# EAGLE design rpi (EAGLE 9.6.2)
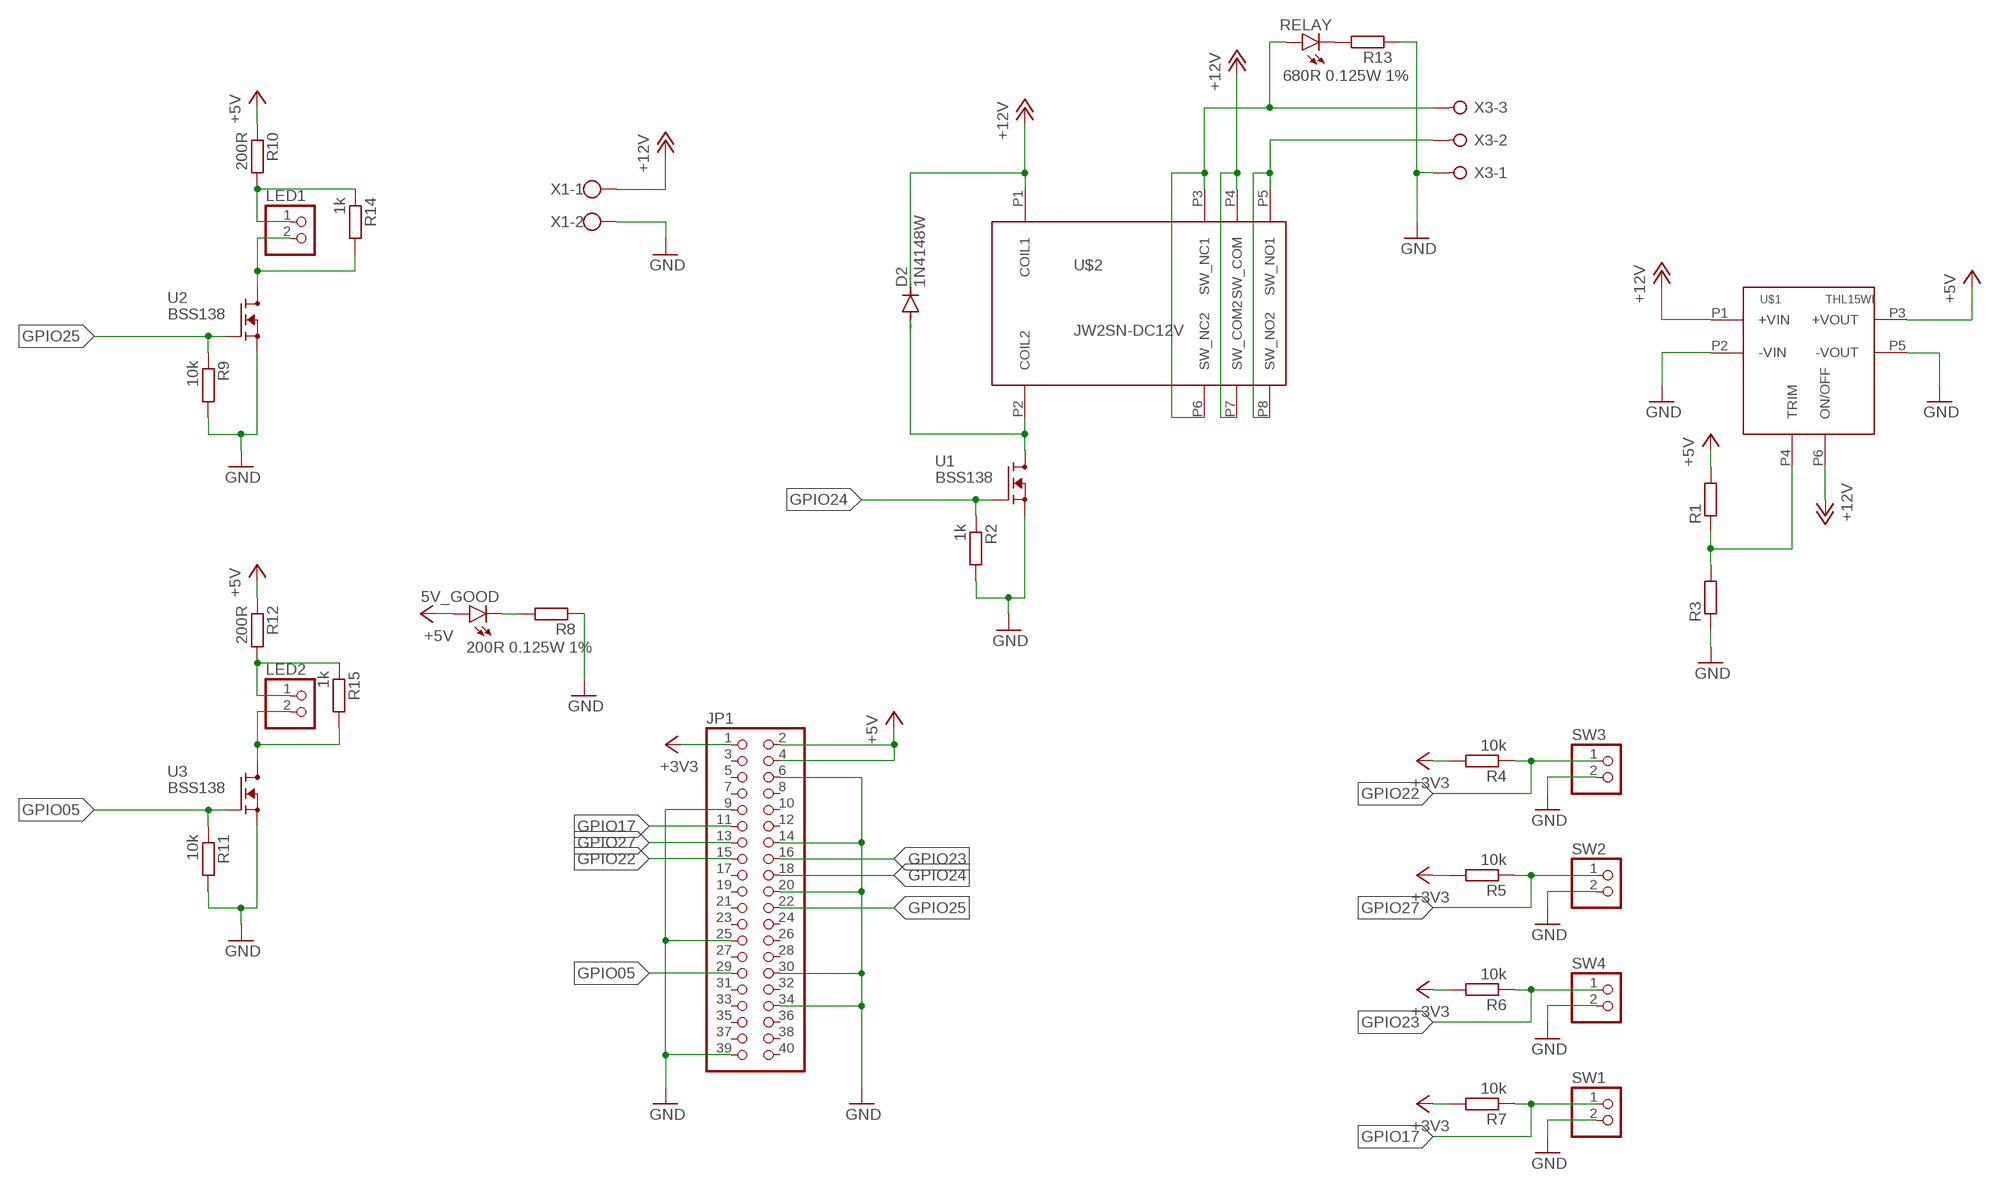
[diagram p0: schematic, sheet 1]

## Parts
5V_GOOD  LEDCHIPLED_0805  [CHIPLED_0805]
D2  1N4148W  CGRM4001-G  [SOD-123_MINI-SMA]
JP1  PINHD-2X20  [2X20]
LED1  PINHD-1X2  [1X02]
LED2  PINHD-1X2  [1X02]
R1  R-EU_R0805  [R0805]
R2  1k  R-EU_R0805  [R0805]
R3  R-EU_R0805  [R0805]
R4  10k  R-EU_R0805  [R0805]
R5  10k  R-EU_R0805  [R0805]
R6  10k  R-EU_R0805  [R0805]
R7  10k  R-EU_R0805  [R0805]
R8  200R 0.125W 1%  R-EU_R0805  [R0805]
R9  10k  R-EU_R0805  [R0805]
R10  200R  R-EU_R0805  [R0805]
R11  10k  R-EU_R0805  [R0805]
R12  200R  R-EU_R0805  [R0805]
R13  680R 0.125W 1%  R-EU_R0805  [R0805]
R14  1k  R-EU_R0805  [R0805]
R15  1k  R-EU_R0805  [R0805]
RELAY  LEDCHIPLED_0805  [CHIPLED_0805]
SW1  PINHD-1X2  [1X02]
SW2  PINHD-1X2  [1X02]
SW3  PINHD-1X2  [1X02]
SW4  PINHD-1X2  [1X02]
U1  BSS138  [SOT23]
U2  BSS138  [SOT23]
U3  BSS138  [SOT23]
U$1  THL15WI  [THL15WI]
U$2  JW2SN-DC12V  [JW2FORMC]
X1  W237-102  [W237-102]
X3  W237-3E  [W237-3E]

## Nets
12VNC [FPGA]: RELAY.A U$2.P3(SW_NC1) U$2.P6(SW_NC2) X3.3
+3V3: JP1.1 R4.2 R5.2 R6.2 R7.2
+5V: 5V_GOOD.A JP1.2 JP1.4 R1.2 R10.1 R12.1 U$1.P3(+VOUT)
+12V: D2.C U$1.P1(+VIN) U$1.P6(ON/OFF) U$2.P1(COIL1) U$2.P4(SW_COM) U$2.P7(SW_COM2) X1.1
GND: JP1.6 JP1.9 JP1.14 JP1.20 JP1.25 JP1.30 JP1.34 JP1.39 R2.2 R3.1 R8.1 R9.2 R11.2 R13.1 SW1.2 SW2.2 SW3.2 SW4.2 U1.2(S) U2.2(S) U3.2(S) U$1.P2(-VIN) U$1.P5(-VOUT) X1.2 X3.1
GPIO05: JP1.29 R11.1 U3.1(G)
GPIO17: JP1.11 R7.1 SW1.1
GPIO22: JP1.15 R4.1 SW3.1
GPIO23: JP1.16 R6.1 SW4.1
GPIO24: JP1.18 R2.1 U1.1(G)
GPIO25: JP1.22 R9.1 U2.1(G)
GPIO27: JP1.13 R5.1 SW2.1
N$1: R1.1 R3.2 U$1.P4(TRIM)
N$2: D2.A U1.3(D) U$2.P2(COIL2)
N$3: LED1.2 R14.2 U2.3(D)
N$4: U$2.P5(SW_NO1) U$2.P8(SW_NO2) X3.2
N$5 [FPGA]: 5V_GOOD.C R8.2
N$6: LED1.1 R10.2 R14.1
N$7: LED2.2 R15.2 U3.3(D)
N$8: LED2.1 R12.2 R15.1
N$11 [FPGA]: R13.2 RELAY.C
Unconnected: JP1.3 JP1.5 JP1.7 JP1.8 JP1.10 JP1.12 JP1.17 JP1.19 JP1.21 JP1.23 JP1.24 JP1.26 JP1.27 JP1.28 JP1.31 JP1.32 JP1.33 JP1.35 JP1.36 JP1.37 JP1.38 JP1.40

## Library data of the parts
5V_GOOD RELAY = led:LED: LED OSRAM: - CHIPLED LG R971, LG N971, LY N971, LG Q971, LY Q971, LO R971, LY R971 LH N974, LH R974 LS Q976, LO Q976, LY Q976 LO Q996 - Hyper CHIPLED LW Q18S LB Q993, LB Q99A, LB R99A - SideLED LS A670, LO A670, LY A670, LG A670, LP A670 LB A673, LV A673, LT A673, LW A673 LH A674 LY A675 LS A676, LA A676, LO A676, LY A676, LW A676 LS A679, LY A679, LG A679 - Hyper Micro SIDELED® LS Y876, LA Y876, LO Y876, LY Y876 LT Y87S - SmartLED LW L88C, LW L88S LB L89C, LB L89S, LG L890 LS L89K, LO L89K, LY L89K LS L896, LA L896, LO L896, LY L896 - TOPLED LS T670, LO T670, LY T670, LG T670, LP T670 LSG T670, LSP T670, LSY T670, LOP T670, LYG T670 LG T671, LOG T671, LSG T671 LB T673, LV T673, LT T673, LW T673 LH T674 LS T676, LA T676, LO T676, LY T676, LB T676, LH T676, LSB T676, LW T676 LB T67C, LV T67C, LT T67C, LS T67K, LO T67K, LY T67K, LW E67C LS E67B, LA E67B, LO E67B, LY E67B, LB E67C, LV E67C, LT E67C LW T67C LS T679, LY T679, LG T679 LS T770, LO T770, LY T770, LG T770, LP T770 LB T773, LV T773, LT T773, LW T773 LH T774 LS E675, LA E675, LY E675, LS T675 LS T776, LA T776, LO T776, LY T776, LB T776 LHGB T686 LT T68C, LB T68C - Hyper Mini TOPLED® LB M676 - Mini TOPLED Santana® LG M470 LS M47K, LO M47K, LY M47K Source: http://www.osram.convergy.de LUXEON: - LUMILED® LXK2-PW12-R00, LXK2-PW12-S00, LXK2-PW14-U00, LXK2-PW14-V00 LXK2-PM12-R00, LXK2-PM12-S00, LXK2-PM14-U00 LXK2-PE12-Q00, LXK2-PE12-R00, LXK2-PE12-S00, LXK2-PE14-T00, LXK2-PE14-U00 LXK2-PB12-K00, LXK2-PB12-L00, LXK2-PB12-M00, LXK2-PB14-N00, LXK2-PB14-P00, LXK2-PB14-Q00 LXK2-PR12-L00, LXK2-PR12-M00, LXK2-PR14-Q00, LXK2-PR14-R00 LXK2-PD12-Q00, LXK2-PD12-R00, LXK2-PD12-S00 LXK2-PH12-R00, LXK2-PH12-S00 LXK2-PL12-P00, LXK2-PL12-Q00, LXK2-PL12-R00 Source: www.luxeon.com KINGBRIGHT: KA-3528ASYC Source: www.kingbright.com
D2 = diode:CGRM400*-G: Molded plasitc,JEDEC SOD-123/Mini SMA Source: Comchip CGRM4001-G.pdf
JP1 = pinhead:PINHD-2X20: PIN HEADER
LED1 LED2 SW1-SW4 = pinhead:PINHD-1X2: PIN HEADER
R1-R7 R9-R12 R14 R15 = rcl:R-EU_: RESISTOR, European symbol; SPICEPREFIX: R
R8 R13 = resistor:R-EU_: RESISTOR, European symbol
U1-U3 = parts:BSS138
U$1 = parts:THL15WI
U$2 = parts:JW2SN-DC12V
X1 = con-wago-500:W237-102: WAGO SCREW CLAMP; MPN: 237-102; OC_FARNELL: unknown; OC_NEWARK: 70K9898
X3 = con-wago-508:W237-3E: WAGO SREW CLAMP; OC_FARNELL: unknown; OC_NEWARK: unknown

## Net classes
3 FPGA: clearance 0.152 mm to class 0, clearance 7.112 mm to class 1, clearance 3.785 mm to class 2, clearance 0.152 mm

## Board
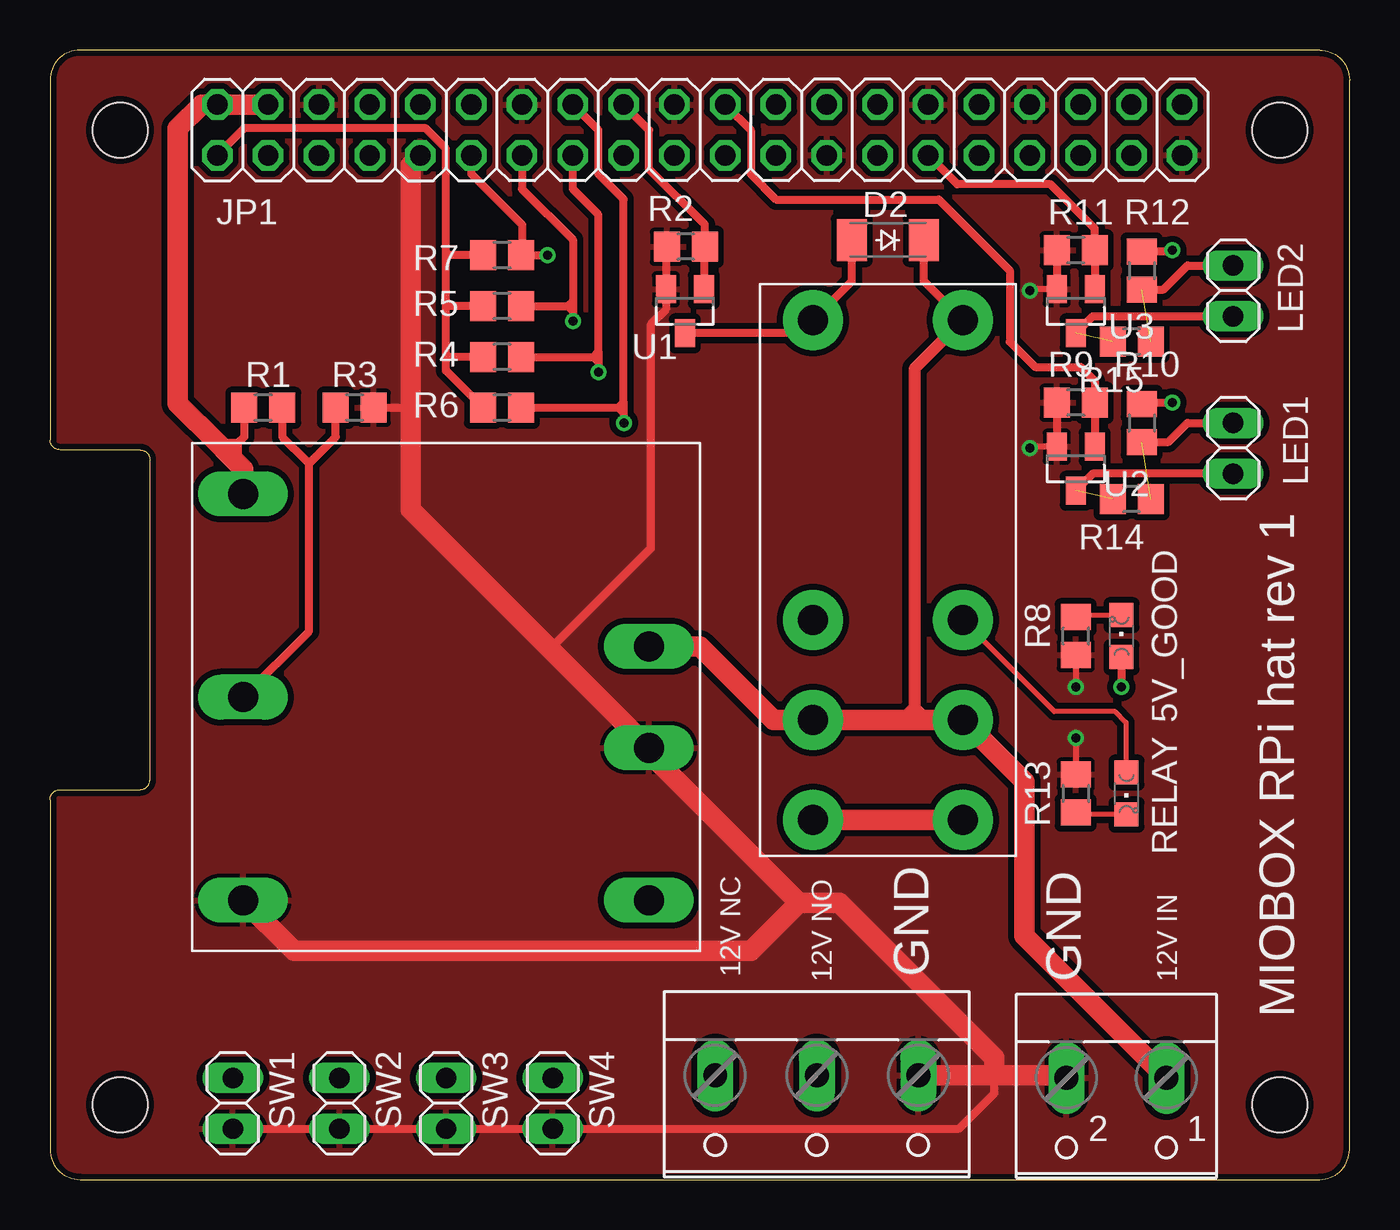
[diagram p1: board, top side]
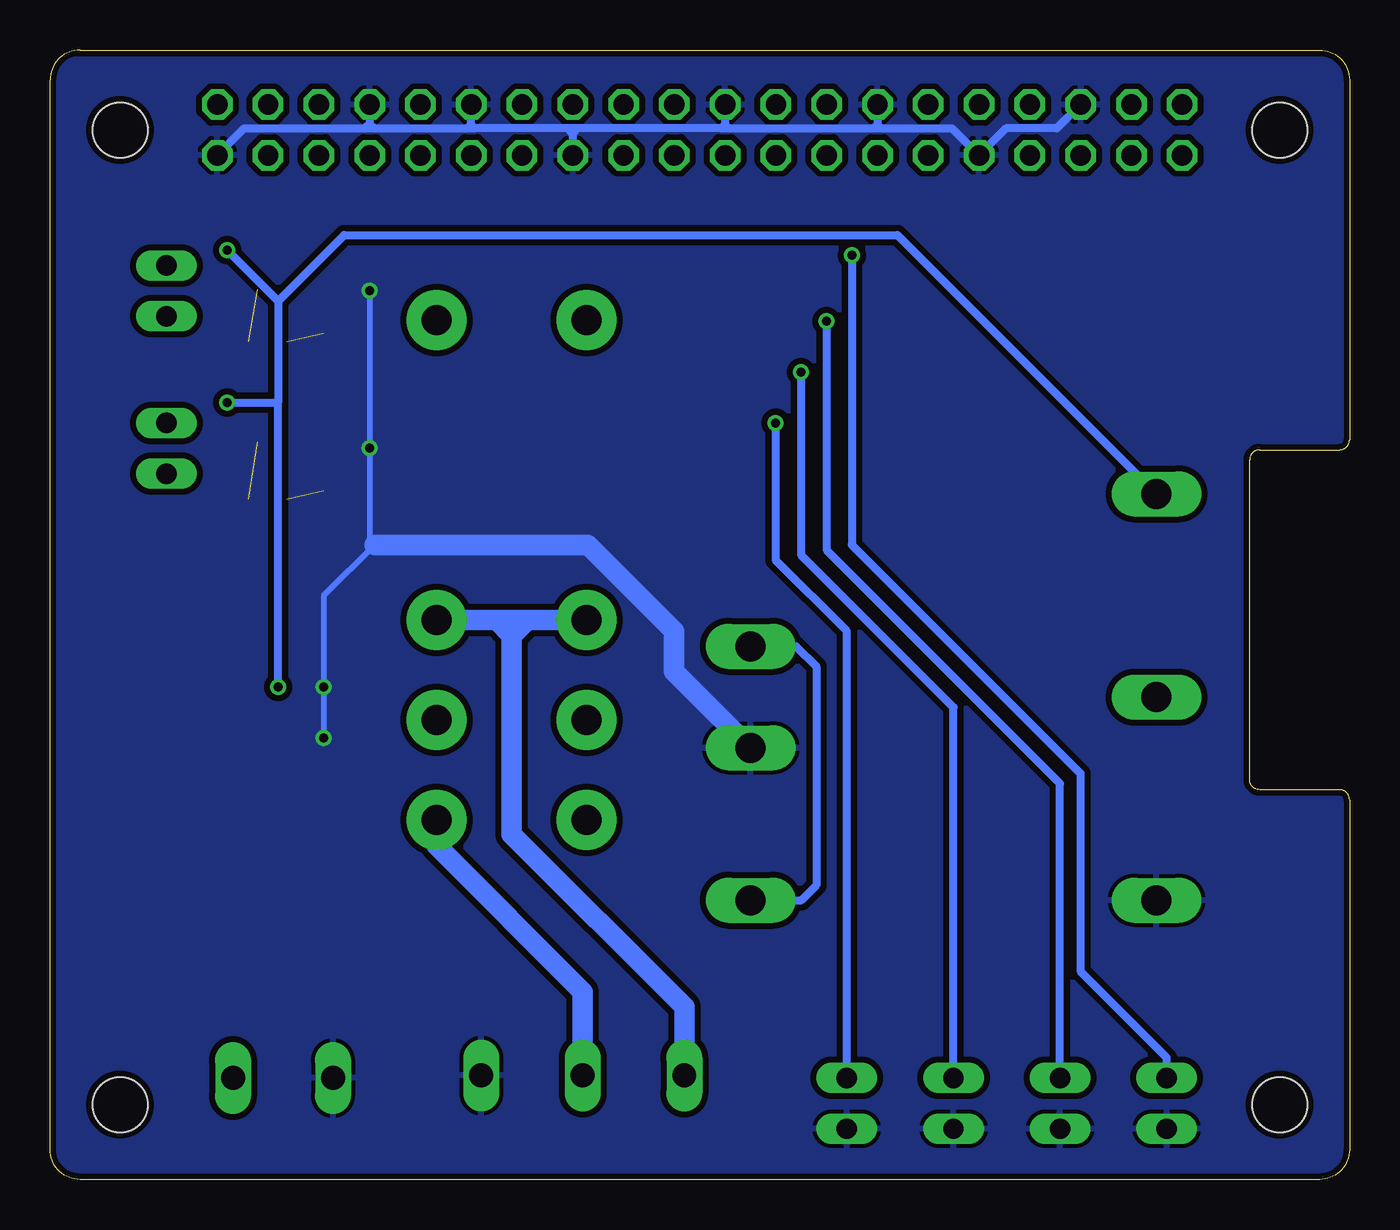
[diagram p2: board, bottom side, seen from below]

Size 65 x 56.5 mm. Coordinates in mm from the lower left corner, seen from the top.
Outline: 1.5,0 63.5,0 arc90 65,1.5 65,55 arc90 63.5,56.5 1.5,56.5 arc90 0,55 0,37 arc90 0.5,36.5 4.5,36.5 arc-90 5,36 5,20 arc-90 4.5,19.5 0.5,19.5 arc90 0,19 0,1.5 arc90 1.5,0
Copper layers (1*16): Top 0.018mm / dielectric 1.55mm / Bottom 0.018mm
Design rules "eC_2Layer_PClass6_BaseCopperO18_eCDefault": minimum track width 0.15mm, minimum drill 0.35mm, track to track 0.15mm, track to pad 0.15mm, pad to pad 0.15mm, via to via 0.15mm, smd to smd 0mil, copper to edge 0.25mm, drill to drill 0.35mm, minimum pad ring 0.175mm, minimum via ring 0.125mm, stop-mask expansion 0mil, vias tented up to drill 0.45mm, thermal gap 0.2mm
Holes 2.75 mm at 3.5,52.5 3.5,3.75 61.5,52.5 61.5,3.75

### Footprints (pad centres in the part's own frame; a part is rotated, then mirrored left to right if it is on the bottom)
CHIPLED_0805 = smd 1.2 x 1.2: A 0,-1.05; C 0,1.05
SOD-123_MINI-SMA = smd 1.5 x 2.1: A 1.8,0; C -1.8,0
2X20 = drill 1.016 octagon: 1 -24.13,-1.27; 2 -24.13,1.27; 3 -21.59,-1.27; 4 -21.59,1.27; 5 -19.05,-1.27; 6 -19.05,1.27; 7 -16.51,-1.27; 8 -16.51,1.27; 9 -13.97,-1.27; 10 -13.97,1.27; 11 -11.43,-1.27; 12 -11.43,1.27; 13 -8.89,-1.27; 14 -8.89,1.27; 15 -6.35,-1.27; 16 -6.35,1.27; 17 -3.81,-1.27; 18 -3.81,1.27; 19 -1.27,-1.27; 20 -1.27,1.27; 21 1.27,-1.27; 22 1.27,1.27; 23 3.81,-1.27; 24 3.81,1.27; 25 6.35,-1.27; 26 6.35,1.27; 27 8.89,-1.27; 28 8.89,1.27; 29 11.43,-1.27; 30 11.43,1.27; 31 13.97,-1.27; 32 13.97,1.27; 33 16.51,-1.27; 34 16.51,1.27; 35 19.05,-1.27; 36 19.05,1.27; 37 21.59,-1.27; 38 21.59,1.27; 39 24.13,-1.27; 40 24.13,1.27
1X02 = drill 1.016 long: 1 -1.27,0; 2 1.27,0
R0805 = smd 1.3 x 1.5: 1 -0.95,0; 2 0.95,0
SOT23 = smd 1 x 1.4: 1 -0.95,-1.1; 2 0.95,-1.1; 3 0,1.1
THL15WI = drill 1.5 long: P1 -2.54,11.42; P2 2.54,11.42; P3 -10.16,-8.88; P4 0,-8.88; P5 10.16,-8.88; P6 10.16,11.42
JW2FORMC = drill 1.5 pad 3: P1 -12.5,3.75; P2 -12.5,-3.75; P3 2.5,3.75; P4 7.5,3.75; P5 12.5,3.75; P6 2.5,-3.75; P7 7.5,-3.75; P8 12.5,-3.75
W237-102 = drill 1.194 long: 1 -2.5,-1.27; 2 2.5,-1.27
W237-3E = drill 1.194 long: 1 -5.08,-0.635; 2 0,-0.635; 3 5.08,-0.635

### Placement (x,y rotation side)
5V_GOOD  53.59,27.18 0 top
D2  41.91,46.99 180 top
JP1  32.5,52.5 0 top
LED1  59.18,36.58 270 top
LED2  59.18,44.45 270 top
R1  10.67,38.61 180 top
R2  31.8,46.66 180 top
R3  15.24,38.61 180 top
R4  22.61,41.15 180 top
R5  22.61,43.69 180 top
R6  22.61,38.61 180 top
R7  22.61,46.23 180 top
R8  51.31,27.18 90 top
R9  51.31,38.86 180 top
R10  54.61,37.85 270 top
R11  51.31,46.48 180 top
R12  54.61,45.47 270 top
R13  51.31,19.3 270 top
R14  54.1,34.04 180 top
R15  54.1,41.91 180 top
RELAY  53.85,19.3 180 top
SW1  9.14,3.81 270 top
SW2  14.48,3.81 270 top
SW3  19.81,3.81 270 top
SW4  25.15,3.81 270 top
U1  31.75,43.43 180 top
U2  51.31,35.56 180 top
U3  51.31,43.43 180 top
U$1  18.54,24.13 270 top
U$2  41.91,30.48 270 top
X1  53.34,3.81 180 top
X3  38.35,4.57 180 top

### Tracks (layer width: path | path; a pad name or v marks a point on that pad's centre or on a via)
12VNC
  Top 0.254: RELAY.A 53.81,20.32 53.81,22.87 53.28,23.41 50.23,23.41 U$2.P3
  Bottom 1.016: X3.3 33.27,8.64 41.91,17.27 41.91,27.18 | U$2.P6 41.11,27.98 | 41.11,27.98 41.66,27.98 | 41.66,27.98 42.67,27.98 | 42.67,27.98 U$2.P3 | 41.66,27.98 41.91,27.73 41.91,27.22 | 41.11,27.98 41.91,27.18 | 41.91,27.18 41.91,27.22 | 41.91,27.22 42.67,27.98
+3V3
  Top 0.406: R6.2 19.81,40.45 19.81,41.15 | 19.81,41.15 19.81,43.69 | 19.81,43.69 19.81,46.23 | R7.2 19.81,46.23 | R4.2 19.81,41.15 | R5.2 19.81,43.69 | JP1.1 9.72,52.58 18.8,52.58 19.81,51.56 19.81,46.23
+5V  (via drill 0.45 pad 0.8)
  Top 0.406: R1.2 9.72,37.15 9.4,36.83 | 5V_GOOD.A v53.59,24.64 | v56.13,46.48 56.07,46.42 R12.1 | R10.1 54.68,38.86 v56.13,38.86 | 9.4,36.83 8.89,36.32 | 9.4,36.83 9.4,35.81 9.66,35.55 | 9.4,36.83 8.38,36.83
  Top 1.016: JP1.4 JP1.2 7.59,53.77 6.4,52.58 6.4,38.81 8.38,36.83 8.89,36.32 9.66,35.55 U$1.P3
  Bottom 0.406: v53.59,24.64 53.59,38.86 | 53.59,43.94 53.59,38.86 | 53.59,43.94 v56.13,46.48 | v56.13,38.86 53.59,38.86 | 53.59,43.94 50.29,47.24 22.62,47.24 U$1.P3
+12V
  Top 0.406: U$2.P1 43.71,44.93 D2.C
  Top 0.61: U$2.P1 43.24,40.56 43.24,23.62 | 43.18,22.98 43.24,23.04 43.24,23.62 | 43.24,23.62 42.6,22.98 42.42,22.98 | 43.24,23.62 43.69,23.17 43.69,22.98
  Top 1.016: X1.1 48.73,12.19 48.73,19.91 U$2.P4 43.69,22.98 43.18,22.98 42.42,22.98 U$2.P7 36.19,22.98 32.5,26.67 U$1.P1
  Bottom 0.406: U$1.P6 27.42,13.97 26.67,14.72 26.67,25.66 27.68,26.67 U$1.P1
GND  (via drill 0.45 pad 0.8)
  Top 0.305: v51.31,22.1 R13.1 | R8.1 v51.31,24.64 | U2.2 49.11,36.66 v49.02,36.58 | U3.2 49.11,44.53 v49.02,44.45
  Top 0.406: R2.2 30.8,46.61 U1.2 30.8,43.52 30.04,42.76 30.04,31.56 25.01,26.54 | R3.1 18.03,38.61 | SW1.2 SW2.2 SW3.2 SW4.2 45.47,2.54 47.24,4.32 47.24,5.21 | R9.2 U2.2 | R11.2 U3.2
  Top 1.016: U$1.P5 12.2,11.43 35.05,11.43 37.47,13.84 | X3.1 47.24,5.21 | 47.24,5.21 50.71,5.21 X1.2 | 47.24,5.21 47.24,6.1 39.5,13.84 37.47,13.84 | 37.47,13.84 29.96,21.35 U$1.P2 25.01,26.54 18.03,33.52 18.03,38.61 18.03,50.73 JP1.9
  Bottom 0.305: v51.31,22.1 v51.31,24.64 51.31,29.21 48.77,31.75 49.02,32 v49.02,36.58 v49.02,44.45
  Bottom 0.406: JP1.6 14.64,52.58 17.18,52.58 JP1.9 19.88,52.58 23.43,52.58 | JP1.14 23.61,52.75 | 23.61,52.75 23.43,52.58 | 31.41,52.58 31.23,52.75 | JP1.20 31.23,52.75 | 43.93,52.75 43.75,52.58 | 43.93,52.75 JP1.30 | 31.41,52.58 38.6,52.58 | 38.6,52.58 38.86,52.58 | 38.86,52.58 39.12,52.58 | 39.12,52.58 43.75,52.58 | JP1.25 38.85,52.32 | 38.85,52.32 38.85,52.57 38.86,52.58 | 38.85,52.32 38.6,52.58 | 38.85,52.32 38.86,52.32 39.12,52.58 | 31.41,52.58 31.05,52.58 | 31.05,52.58 23.79,52.58 | 23.79,52.58 23.43,52.58 | 31.05,52.58 31.23,52.75 | 23.79,52.58 23.61,52.75 | JP1.39 55.28,52.58 49.25,52.58 | 49.25,52.58 48.77,52.58 | 48.77,52.58 44.11,52.58 | 44.11,52.58 43.75,52.58 | 44.11,52.58 43.93,52.75 | JP1.34 49.01,52.82 | 49.01,52.82 48.77,52.58 | 49.01,52.82 49.25,52.58
  Bottom 1.016: U$1.P2 33.78,25.41 33.78,27.43 38.1,31.75 48.77,31.75
  pour Bottom (isolate 0.305): -1.78,0.25 -1.78,57.4 66.29,57.4 66.55,57.66 66.55,-1.78 -1.52,-1.78 -1.78,-1.52
  pour Top (isolate 0.305): -4.32,0 -4.32,58.67 -4.57,58.93 67.56,58.93 67.82,58.67 67.82,-3.81 68.07,-4.06 -4.32,-4.06
GPIO05
  Top 0.406: U3.1 R11.1 52.26,47.56 50.04,49.78 45.38,49.78 JP1.29
GPIO17  (via drill 0.45 pad 0.8)
  Top 0.406: v24.89,46.23 R7.1 23.62,46.29 23.62,47.75 21.07,50.3 JP1.11
  Bottom 0.406: v24.89,46.23 24.89,31.75 13.46,20.32 13.46,10.41 9.14,6.1 SW1.1
GPIO22  (via drill 0.45 pad 0.8)
  Top 0.406: R4.1 27.18,41.15 | 27.18,41.15 27.43,41.15 | 27.43,41.4 27.43,41.15 | 27.43,41.15 27.43,40.89 | 27.43,40.89 v27.43,40.39 | 27.18,41.15 27.43,41.4 | 27.18,41.15 27.43,40.89 | 27.43,41.4 27.43,48.26 26.15,49.54 JP1.15
  Bottom 0.406: v27.43,40.39 27.43,31.24 19.81,23.62 SW3.1
GPIO23  (via drill 0.45 pad 0.8)
  Top 0.406: 28.69,38.86 28.69,38.61 | 28.69,38.61 28.44,38.61 | R6.1 28.44,38.61 | 28.69,38.61 28.69,38.35 | 28.69,38.35 v28.69,37.86 v28.7,37.85 | 28.44,38.61 28.69,38.86 | 28.44,38.61 28.69,38.35 | 28.69,38.86 28.69,49.03 27.43,50.29 27.43,52.49 JP1.16
  Bottom 0.406: v28.7,37.85 28.7,30.99 25.15,27.43 SW4.1
GPIO24
  Top 0.406: U1.1 32.7,46.61 R2.1 32.75,47.77 29.97,50.55 29.97,52.49 JP1.18
GPIO25
  Top 0.406: JP1.22 35.05,52.49 35.05,50.29 36.32,49.02 44.45,49.02 48.01,45.47 48.01,41.91 49.28,40.64 51.56,40.64 52.26,39.94 R9.1 U2.1
GPIO27  (via drill 0.45 pad 0.8)
  Top 0.406: 26.15,43.94 26.15,43.69 | 26.15,43.69 25.91,43.69 | R5.1 25.91,43.69 | 26.15,43.69 26.15,43.45 | 26.15,43.45 v26.15,42.94 v26.16,42.93 | 25.91,43.69 25.91,43.7 26.15,43.94 | 25.91,43.69 26.15,43.45 | 26.15,43.94 26.15,47 23.61,49.54 JP1.13
  Bottom 0.406: v26.16,42.93 26.16,31.5 14.48,19.81 SW2.1
N$1
  Top 0.406: U$1.P4 12.95,27.42 12.95,35.81 | R1.1 11.62,37.15 12.83,35.94 | 12.95,35.81 13.08,35.94 | R3.2 14.29,37.15 13.21,36.07 13.08,35.94 | 12.83,35.94 12.95,35.81 | 12.83,35.94 13.08,35.94
N$2
  Top 0.406: U1.3 37.51,42.33 U$2.P2 40.11,44.93 D2.A
N$3  (1 unrouted)
  Top 0.406: U2.3 52.15,35.31 LED1.2
N$4
  Top 1.016: U$2.P5 U$2.P8
  Bottom 1.016: X3.2 38.35,9.4 45.66,16.7 U$2.P5
N$5
  Top 0.254: R8.2 51.41,28.23 5V_GOOD.C
N$6  (1 unrouted)
  Top 0.406: R10.2 55.95,36.9 56.9,37.85 LED1.1
N$7  (1 unrouted)
  Top 0.406: U3.3 52.15,43.18 LED2.2
N$8  (1 unrouted)
  Top 0.406: R12.2 55.69,44.52 56.9,45.72 LED2.1
N$11
  Top 0.254: RELAY.C 51.41,18.25 R13.2

### Text on the board
tPlace: 12V NC | 12V NO | GND | GND | 12V IN
tNames: MIOBOX RPi hat rev 1